# Altium project 1.3_prelab.PrjPcb
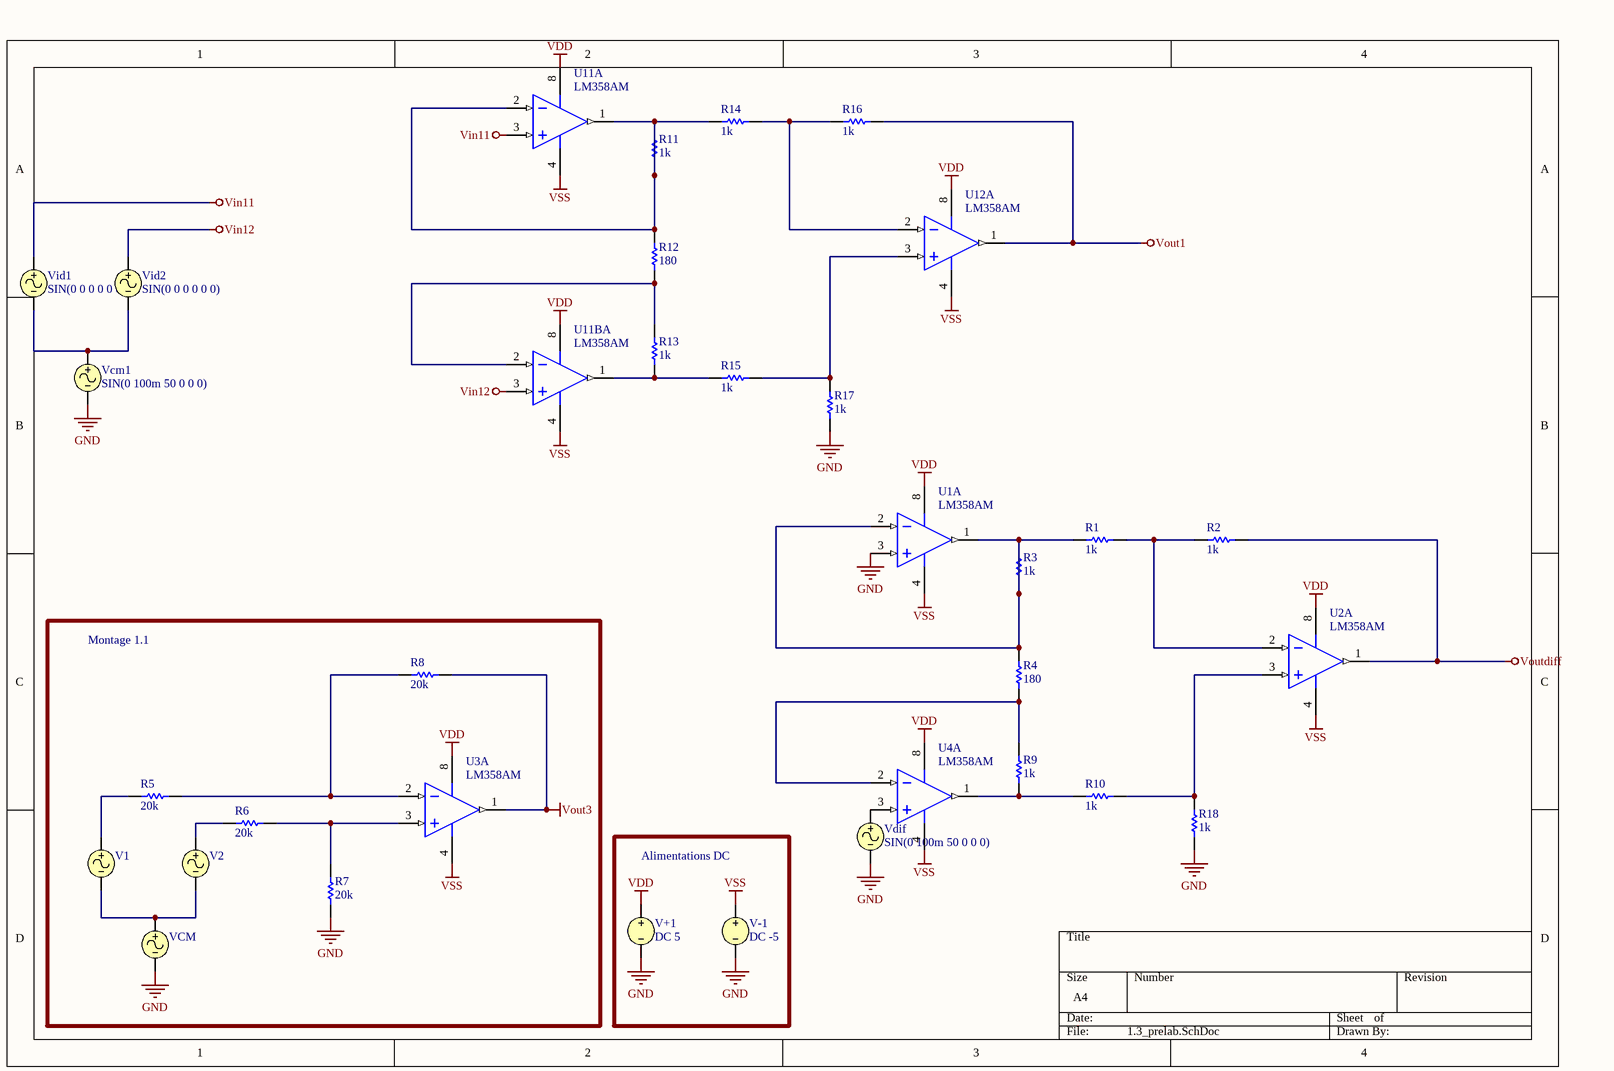
[diagram p0: 1.3_prelab.SchDoc]
1 sheet, 34 parts. Net scope: global (net labels, ports and power ports of the same name join across sheets).

## Sheet 1.3_prelab.SchDoc
size A4; SheetNumber: 1; SheetTotal: 1; SPICEModelCacheBLAVZCWF: <root> / <DocumentId>BLAVZCWF</DocumentId> / <CacheFrame Number="0"> / <Model Name="lm358" Kind="CKT"> / <Text>*////////////////////////////////////////////////////////// / *LM358 DUAL OPERATIONAL AMPLIFIER MACRO-MODEL / *////////////////////////////////////////////////////////// / * / * connections:      non-inverting input / *                   |   inverting input / *                   |   |   positive power supply / *                   |   |   |   negative power supply / *                   |   |   |   |   output / *                   |   |   |   |   | / *                   |   |   |   |   | / .SUBCKT LM358       1   2  99  50  28 / * / * PINOUT ORDER +IN -IN V+ V- OUT / * / * / *Features: / *Eliminates need for dual supplies / *Large DC voltage gain =             100dB / *High bandwidth =                     1MHz / *Low input offset voltage =            2mV / *Wide supply range =       +-1.5V to +-16V / * / *NOTE: Model is for single device only and simulated / *      supply current is 1/2 of total device current. / *      Output crossover distortion with dual supplies / *      is not modeled. / * / ****************INPUT STAGE************** / * / IOS 2 1 5N / *^Input offset current / R1 1 3 500K / R2 3 2 500K / I1 99 4 100U / R3 5 50 517 / R4 6 50 517 / Q1 5 2 4 QX / Q2 6 7 4 QX / *Fp2=1.2 MHz / C4 5 6 128.27P / * / ***********COMMON MODE EFFECT*********** / * / I2 99 50 75U / *^Quiescent supply current / EOS 7 1 POLY(1) 16 49 2E-3 1 / *Input offset voltage.^ / R8 99 49 60K / R9 49 50 60K / * / *********OUTPUT VOLTAGE LIMITING******** / V2 99 8 1.63 / D1 9 8 DX / D2 10 9 DX / V3 10 50 .635 / * / **************SECOND STAGE************** / * / EH 99 98 99 49 1 / G1 98 9 POLY(1) 5 6 0 9.8772E-4 0 .3459 / *Fp1=7.86 Hz / R5 98 9 101.2433MEG / C3 98 9 200P / * / ***************POLE STAGE*************** / * / *Fp=2 MHz / G3 98 15 9 49 1E-6 / R12 98 15 1MEG / C5 98 15 7.9577E-14 / * / *********COMMON-MODE ZERO STAGE********* / * / *Fpcm=10 KHz / G4 98 16 3 49 5.6234E-8 / L2 98 17 15.9M / R13 17 16 1K / * / **************OUTPUT STAGE************** / * / F6 50 99 POLY(1) V6 300U 1 / E1 99 23 99 15 1 / R16 24 23 17.5 / D5 26 24 DX / V6 26 22 .63V / R17 23 25 17.5 / D6 25 27 DX / V7 22 27 .63V / V5 22 21 0.27V / D4 21 15 DX / V4 20 22 0.27V / D3 15 20 DX / L3 22 28 500P / RL3 22 28 100K / * / ***************MODELS USED************** / * / .MODEL DX D(IS=1E-15) / .MODEL QX PNP(BF=1.111E3) / * / .ENDS</Text> / </Model> / </CacheFrame> / </root>

### Parts
R1  value 1k  (hidden comment: Resistor)
R2  value 1k  (hidden comment: Resistor)
R3  value 1k  (hidden comment: Resistor)
R4  value 180  (hidden comment: Resistor)
R5  value 20k  (hidden comment: Resistor)
R6  value 20k  (hidden comment: Resistor)
R7  value 20k  (hidden comment: Resistor)
R8  value 20k  (hidden comment: Resistor)
R9  value 1k  (hidden comment: Resistor)
R10  value 1k  (hidden comment: Resistor)
R11  value 1k  (hidden comment: Resistor)
R12  value 180  (hidden comment: Resistor)
R13  value 1k  (hidden comment: Resistor)
R14  value 1k  (hidden comment: Resistor)
R15  value 1k  (hidden comment: Resistor)
R16  value 1k  (hidden comment: Resistor)
R17  value 1k  (hidden comment: Resistor)
R18  value 1k  (hidden comment: Resistor)
U1  LM358AM  [M08A_N]  (part A of 2)
U2  LM358AM  [M08A_N]  (part A of 2)
U3  LM358AM  [M08A_N]  (part A of 2)
U4  LM358AM  [M08A_N]  (part A of 2)
U11  LM358AM  [M08A_N]  (part A of 2)
U11B  LM358AM  [M08A_N]  (part A of 2)
U12  LM358AM  [M08A_N]  (part A of 2)
V1  SIN(0 0 0 0 0 0)  (value not drawn)
V2  SIN(0 0 0 0 0 0)  (value not drawn)
V+1  DC 5
V-1  DC -5
VCM  SIN(0 0 0 0 0 0)  (value not drawn)
Vcm1  SIN(0 100m 50 0 0 0)
Vdif  SIN(0 100m 50 0 0 0)
Vid1  SIN(0 0 0 0 0 0)
Vid2  SIN(0 0 0 0 0 0)

### Blocks framed on the sheet
Montage 1.1: R5-R8 U3 V1 V2 VCM
Alimentations DC: V+1 V-1

### Nets
GND: R7.1 R17.1 R18.1 U1.3(INA+) V+1.2 V-1.2 VCM.2 Vcm1.2 Vdif.2
VDD: U1.8(V+) U2.8(V+) U3.8(V+) U4.8(V+) U11.8(V+) U11B.8(V+) U12.8(V+) V+1.1
Vin11: U11.3(INA+) Vid1.1
Vin12: U11B.3(INA+) Vid2.1
Vout1: R16.1 U12.1(OUTA)
Vout3: R8.2 U3.1(OUTA)
Voutdiff: R2.1 U2.1(OUTA)
VSS: U1.4(GND) U2.4(GND) U3.4(GND) U4.4(GND) U11.4(GND) U11B.4(GND) U12.4(GND) V-1.1
NetR1_1: R1.1 R2.2 U2.2(INA-)
NetR1_2: R1.2 R3.1 R3.2 R4.2 U1.1(OUTA) U1.2(INA-)
NetR4_1: R4.1 R9.2 U4.2(INA-)
NetR5_1: R5.1 V1.1
NetR5_2: R5.2 R8.1 U3.2(INA-)
NetR6_1: R6.1 V2.1
NetR6_2: R6.2 R7.2 U3.3(INA+)
NetR9_1: R9.1 R10.2 U4.1(OUTA)
NetR10_1: R10.1 R18.2 U2.3(INA+)
NetR11_1: R11.1 R11.2 R12.2 R14.2 U11.1(OUTA) U11.2(INA-)
NetR12_1: R12.1 R13.2 U11B.2(INA-)
NetR13_1: R13.1 R15.2 U11B.1(OUTA)
NetR14_1: R14.1 R16.2 U12.2(INA-)
NetR15_1: R15.1 R17.2 U12.3(INA+)
NetU4_3: U4.3(INA+) Vdif.1
NetV1_2: V1.2 V2.2 VCM.1
NetVcm1_1: Vcm1.1 Vid1.2 Vid2.2

### Library data of the parts
R1-R18 = Resistor: TC1: 0; SimulationGenericComponent: True; TC2: 0
U1-U4 U11 U11B U12 = LM358AM: Low Power Dual Operational Amplifier; Manufacturer: National Semiconductor; CompType: Amplifiers; PackageTopMarking: NSZXTT*LM*358AM; PowerWise: N; Published: 4-Dec-2008; LatestRevisionDate: 13-Jan-2009; LatestRevisionNote: Sim Model Added.; DatasheetVersion: Oct-2005; PackageVersion: revL, Sep-2006; PackageReference: M08A; Publisher: Altium Limited; PackageDescription: SOIC Narrow, 4.9 x 3.9 x 1.45mm, 8 Lead, 1.27mm Pitch; PartNumber: LM358AM; RoHS: O; PinCount: 8; DigiKeyPartNumber: LM358AMXCT-ND; Code_JEDEC: MS-012-AA; Code_IPC: SOIC127P600-8; ComponentLink1Description: LM358 Datasheet; ComponentLink1URL: http://www.national.com/ds/LM/LM358.pdf; ComponentLink2Description: LM358 Web Page; ComponentLink2URL: http://www.national.com/pf/LM/LM358.html; ComponentLink3Description: M08A Package Page; ComponentLink3URL: http://www.national.com/packaging/folders/m08a.html
V1 V2 VCM = VSIN: Sinusoidal Voltage Source; Note: PCB Footprint - Not required; Offset: 0; AC Magnitude: 1; Published: 8-Jun-2000; LatestRevisionDate: 15-Nov-2004; LatestRevisionNote: Corrected Netlist.; PackageReference: Not Applicable; Publisher: Altium Limited; Amplitude: 0; Frequency: 0; Delay: 0; Damping Factor: 0; Phase: 0; DC Magnitude: 0; AC Phase: 0
V+1 = VSRC: Voltage Source; Note: PCB Footprint - Not required; Value: 5; Published: 8-Jun-2000; LatestRevisionDate: 17-Jul-2002; LatestRevisionNote: Re-released for DXP Platform.; PackageReference: Not Applicable; Publisher: Altium Limited
V-1 = VSRC: Voltage Source; Note: PCB Footprint - Not required; Published: 8-Jun-2000; LatestRevisionDate: 17-Jul-2002; LatestRevisionNote: Re-released for DXP Platform.; PackageReference: Not Applicable; Publisher: Altium Limited; Value: -5
Vcm1 Vdif = VSIN: Sinusoidal Voltage Source; Note: PCB Footprint - Not required; Offset: 0; Frequency: 50; AC Magnitude: 1; Published: 8-Jun-2000; LatestRevisionDate: 15-Nov-2004; LatestRevisionNote: Corrected Netlist.; PackageReference: Not Applicable; Publisher: Altium Limited; Amplitude: 100m; Delay: 0; Damping Factor: 0; Phase: 0; DC Magnitude: 0; AC Phase: 0
Vid1 Vid2 = VSIN: Sinusoidal Voltage Source; Note: PCB Footprint - Not required; Offset: 0; Published: 8-Jun-2000; LatestRevisionDate: 15-Nov-2004; LatestRevisionNote: Corrected Netlist.; PackageReference: Not Applicable; Publisher: Altium Limited; Amplitude: 0; Frequency: 0; Delay: 0; Damping Factor: 0; Phase: 0; DC Magnitude: 0; AC Magnitude: 0; AC Phase: 0